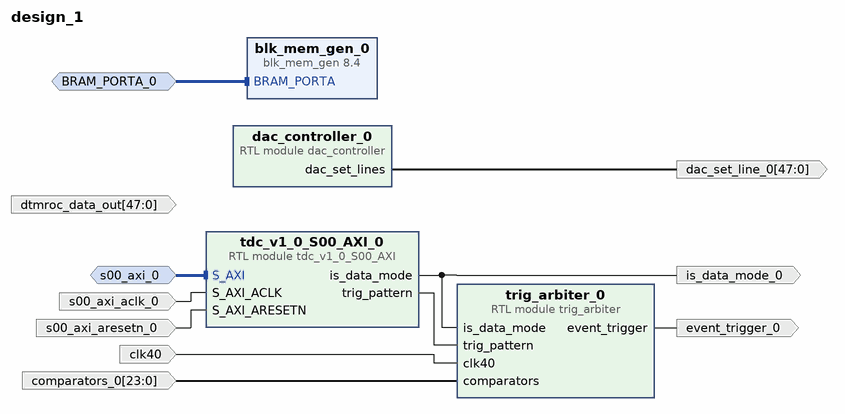
[diagram p0: block diagram of the top level]
# Vivado block design design_1, xc7z010clg400-1, Vivado 2018.1
create_bd_design design_1

create_bd_intf_port -mode Slave -vlnv xilinx.com:interface:bram_rtl:1.0 BRAM_PORTA_0
create_bd_intf_port -mode Slave -vlnv xilinx.com:interface:aximm_rtl:1.0 s00_axi_0
set_property -dict [list \
  CONFIG.DATA_WIDTH 32 \
  CONFIG.PROTOCOL AXI4LITE \
  CONFIG.ID_WIDTH 0 \
  CONFIG.ADDR_WIDTH 16 \
  CONFIG.AWUSER_WIDTH 0 \
  CONFIG.ARUSER_WIDTH 0 \
  CONFIG.WUSER_WIDTH 0 \
  CONFIG.RUSER_WIDTH 0 \
  CONFIG.BUSER_WIDTH 0 \
  CONFIG.READ_WRITE_MODE READ_WRITE \
  CONFIG.HAS_BURST 0 \
  CONFIG.HAS_LOCK 0 \
  CONFIG.HAS_PROT 1 \
  CONFIG.HAS_CACHE 0 \
  CONFIG.HAS_QOS 0 \
  CONFIG.HAS_REGION 0 \
  CONFIG.HAS_WSTRB 1 \
  CONFIG.HAS_BRESP 1 \
  CONFIG.HAS_RRESP 1 \
  CONFIG.SUPPORTS_NARROW_BURST 0 \
  CONFIG.NUM_READ_OUTSTANDING 1 \
  CONFIG.NUM_WRITE_OUTSTANDING 1 \
  CONFIG.MAX_BURST_LENGTH 1 \
  CONFIG.NUM_READ_THREADS 1 \
  CONFIG.NUM_WRITE_THREADS 1 \
  CONFIG.RUSER_BITS_PER_BYTE 0 \
  CONFIG.WUSER_BITS_PER_BYTE 0 \
] [get_bd_intf_ports s00_axi_0]
create_bd_port -dir I -from 23 -to 0 comparators_0
create_bd_port -dir O event_trigger_0
create_bd_port -dir I -type clk s00_axi_aclk_0
create_bd_port -dir I -type rst s00_axi_aresetn_0
create_bd_port -dir O is_data_mode_0
create_bd_port -dir O -from 47 -to 0 dac_set_line_0
create_bd_port -dir I clk40
create_bd_port -dir I -from 47 -to 0 dtmroc_data_out

create_bd_cell -type ip -vlnv xilinx.com:ip:blk_mem_gen:8.4 blk_mem_gen_0
set_property -dict [list \
  CONFIG.Memory_Type True_Dual_Port_RAM \
  CONFIG.Enable_32bit_Address false \
  CONFIG.Use_Byte_Write_Enable false \
  CONFIG.Algorithm Fixed_Primitives \
  CONFIG.Write_Width_A 144 \
  CONFIG.Read_Width_A 144 \
  CONFIG.Write_Width_B 144 \
  CONFIG.Read_Width_B 144 \
  CONFIG.Enable_B Use_ENB_Pin \
  CONFIG.Register_PortA_Output_of_Memory_Primitives true \
  CONFIG.Register_PortB_Output_of_Memory_Primitives true \
  CONFIG.Use_RSTA_Pin false \
  CONFIG.Use_RSTB_Pin false \
  CONFIG.Port_B_Clock 100 \
  CONFIG.Port_B_Write_Rate 50 \
  CONFIG.Port_B_Enable_Rate 100 \
  CONFIG.use_bram_block Stand_Alone \
] [get_bd_cells blk_mem_gen_0]
create_bd_cell -type module -reference trig_arbiter trig_arbiter_0
create_bd_cell -type module -reference tdc_v1_0_S00_AXI tdc_v1_0_S00_AXI_0
create_bd_cell -type module -reference dac_controller dac_controller_0

# ---- connections ----

connect_bd_intf_net -intf_net BRAM_PORTA_0_1 [get_bd_intf_ports BRAM_PORTA_0] [get_bd_intf_pins blk_mem_gen_0/BRAM_PORTA]
connect_bd_intf_net -intf_net s00_axi_0_1 [get_bd_intf_ports s00_axi_0] [get_bd_intf_pins tdc_v1_0_S00_AXI_0/S_AXI]
connect_bd_net -net clk40_0_1 [get_bd_ports clk40] [get_bd_pins trig_arbiter_0/clk40]
connect_bd_net -net comparators_0_1 [get_bd_ports comparators_0] [get_bd_pins trig_arbiter_0/comparators]
connect_bd_net [get_bd_pins trig_arbiter_0/event_trigger] [get_bd_ports event_trigger_0]
connect_bd_net [get_bd_pins tdc_v1_0_S00_AXI_0/trig_pattern] [get_bd_pins trig_arbiter_0/trig_pattern]
connect_bd_net -net s00_axi_aclk_0_1 [get_bd_ports s00_axi_aclk_0] [get_bd_pins tdc_v1_0_S00_AXI_0/S_AXI_ACLK]
connect_bd_net -net s00_axi_aresetn_0_1 [get_bd_ports s00_axi_aresetn_0] [get_bd_pins tdc_v1_0_S00_AXI_0/S_AXI_ARESETN]
connect_bd_net [get_bd_pins tdc_v1_0_S00_AXI_0/is_data_mode] [get_bd_ports is_data_mode_0] [get_bd_pins trig_arbiter_0/is_data_mode]
connect_bd_net [get_bd_pins dac_controller_0/dac_set_lines] [get_bd_ports dac_set_line_0]

validate_bd_design
save_bd_design
